# Altium schematic sheet GZ7_1_x-ALARM.SchDoc: GZ4E-1-0
size B; Revision: 3.1; SheetNumber: 3; SheetTotal: 9
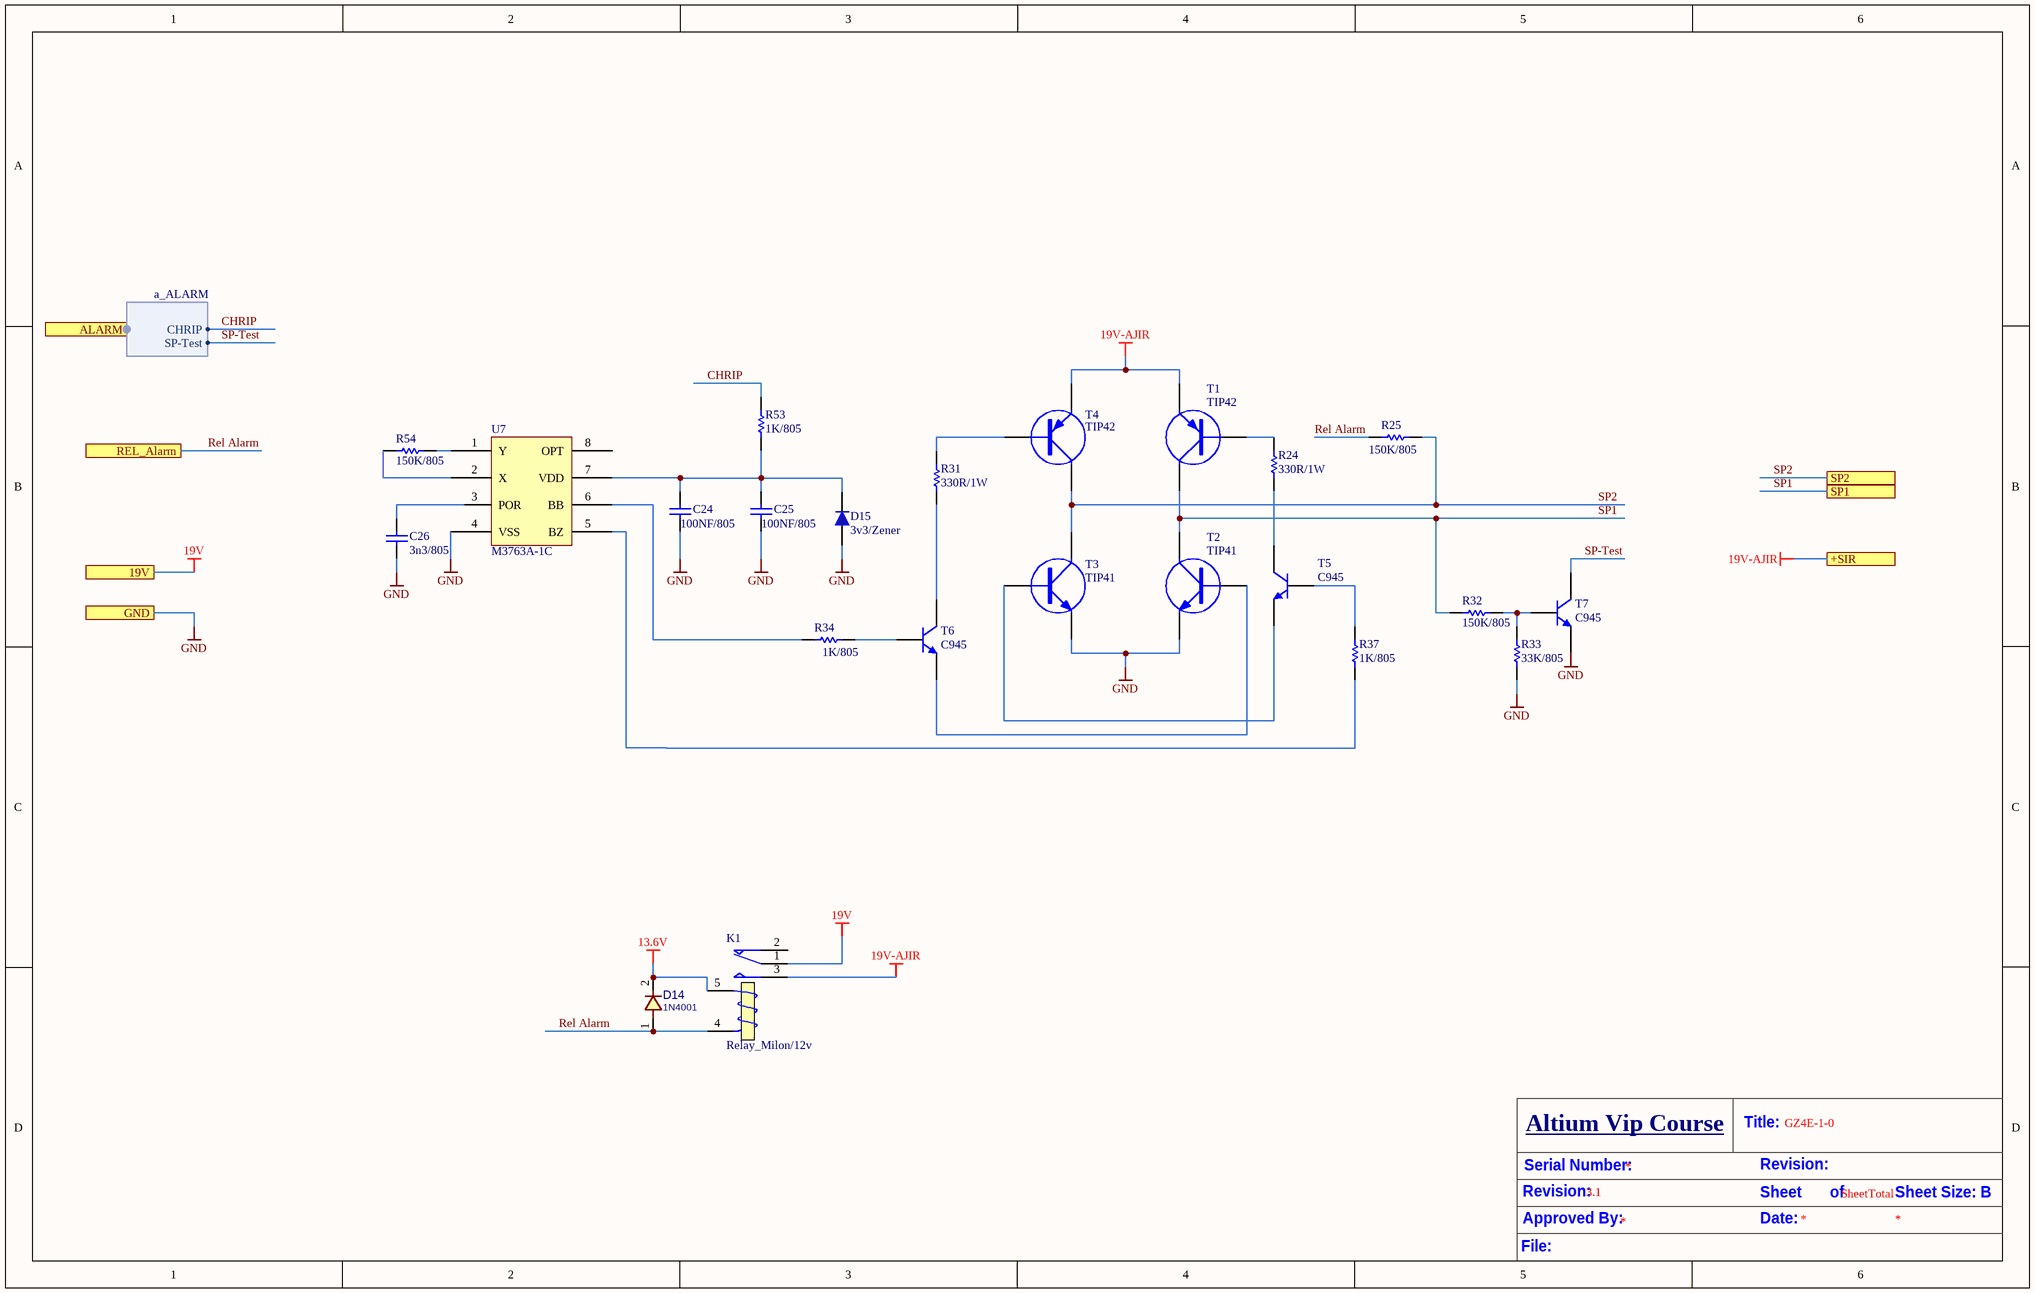
[diagram p0: GZ7_1_x-ALARM.SchDoc]

## Parts
C24  100NF/805  [MY805 COP]
C25  100NF/805  [MY805 COP]
C26  3n3/805  [MY805 COP]
D14  1N4001  [DIODE 1N4007 SMD]
D15  3v3/Zener  [my-DO5X.1.5]
K1  Relay_Milon/12v  [REL]
R24  330R/1W  [R2512]
R25  150K/805  [my805]
R31  330R/1W  [R2512]
R32  150K/805  [my805]
R33  33K/805  [my805]
R34  1K/805  [my805]
R37  1K/805  [my805]
R53  1K/805  [my805]
R54  150K/805  [my805]
T1  TIP42  [TO-220 AB]
T2  TIP41  [TO-220 AB]
T3  TIP41  [TO-220 AB]
T4  TIP42  [TO-220 AB]
T5  C945  [SOT23_N]
T6  C945  [SOT23_N]
T7  C945  [SOT23_N]
U7  M3763A-1C  [DIP8]

## Ports
19V, +SIR, ALARM (harness a_ALARM), GND, REL_Alarm, SP1, SP2

## Harnesses
a_ALARM: SP-Test, CHRIP

## Nets
13.6V: D14.2 K1.5(T2)
19V: K1.1(COM) ; port 19V
19V-AJIR: K1.3(NO) T1.3(C) T4.3(C) ; port +SIR
GND: C24.1 C25.1 C26.1 D15.1 R33.2 T2.3(E) T3.3(E) T7.2(E) U7.4(VSS) ; port GND
CHRIP: R53.2 ; port ALARM.CHRIP
Rel Alarm: D14.1 K1.4(T1) R25.1 ; port REL_Alarm
SP1: R32.1 T1.2(E) T2.2(C) ; port SP1
SP2: R25.2 T3.2(C) T4.2(E) ; port SP2
SP-Test: T7.3(C) ; port ALARM.SP-Test
NetC24_2: C24.2 C25.2 D15.2 R53.1 U7.7(VDD)
NetC26_2: C26.2 U7.3(POR)
NetR24_1: R24.1 T5.3(C)
NetR24_2: R24.2 T1.1(B)
NetR31_1: R31.1 T6.3(C)
NetR31_2: R31.2 T4.1(B)
NetR32_2: R32.2 R33.1 T7.1(B)
NetR34_1: R34.1 T6.1(B)
NetR34_2: R34.2 U7.6(BB)
NetR37_1: R37.1 U7.5(BZ)
NetR37_2: R37.2 T5.1(B)
NetR54_1: R54.1 U7.2(X)
NetR54_2: R54.2 U7.1(Y)
NetT2_1: T2.1(B) T6.2(E)
NetT3_1: T3.1(B) T5.2(E)

Not connected (* = marked no-connect by the designer): K1 2(NC); U7 8(OPT)

## Notes on the sheet
- Serial Number:
- Altium Vip Course
- Title:
- Revision:
- Approved By:
- Date:
- Sheet       of
- SheetTotal
- Sheet Size: B
- File:

## Library data of the parts
C24-C26 = CAP SMD 0805: CAP 0805; Designer: Abbas Basereh; Desc.: CAP SMD 0805; Data: 16-12-2016
D14 = DIODE_THD: DIODE, THD; DESC: DESCRIPTION; PARAM: 100V; PARAM2: 1A; MANF: MANF; ASSEMBLY: ASSEMBLY; PRICE: PRICE; MANF_P#: 1N4001; VALUE: 1N4001
D15 = 1N4148 SMD: Zener
K1 = RELAY General: Relay_Milon; Designer: Ali Hafizi; Company: E.P.I.L; Design_Date: 2011/10/31
R24 R31 = RES Axial 1W: Designer: Abbas Basereh; Desc.: RES Axial 1W; Data: 4-1-2017
R25 R32 R33 = RES Axial 1W: RES 805; Designer: Abbas Basereh; Desc.: RES Axial 1W; Data: 4-1-2017
R34 R37 R53 R54 = RES 1206 0.25W: RES 805; Designer: Abbas Basereh; Desc.: RES SMD 1206; Data: 16-12-2016
T1 T4 = PNP: PNP Transistor
T2 T3 = NPN: NPN Transistor
T5-T7 = C945: NPN Transistor; Published: 2017-2-8; LatestRevisionDate: 2017; LatestRevisionNote: IPC-7351 Footprint Added.; DatasheetVersion: 2017; PackageVersion: 2017-2-8; PackageReference: SOT23; Publisher: Abbas Basereh; PackageDescription: 3-Pin SOT-23 Package 0.95 mm Pitch, 2.3 mm Lead Span; ComponentLink1Description: Manufacturer Link; ComponentLink1URL: http://www.taitroncomponents.com/; ComponentLink2Description: Datasheet; ComponentLink2URL: http://www.taitroncomponents.com/